# Altium schematic sheet tps79333.SchDoc
size A4; SheetNumber: 4; SheetTotal: 7
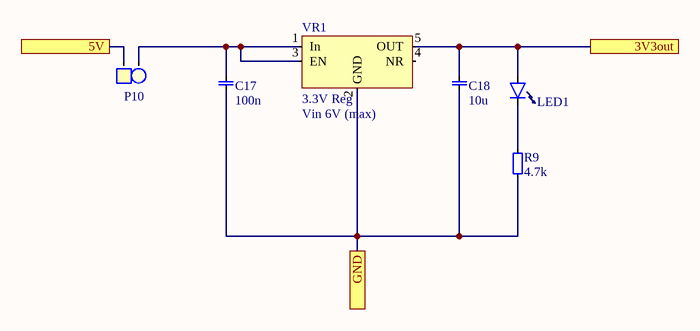
[diagram p0: tps79333.SchDoc]

## Parts
C17  value 100n  [1206, capasitor]  (hidden comment: 1206, capacitor)
C18  value 10u  [1206, capasitor]  (hidden comment: 1206, capacitor)
LED1  0805, LED  [0805_led]  (value not drawn)
P10  1x2 Pin Header  [1x2HEADER]  (value not drawn)
R9  value 4.7k  [1206]  (hidden comment: 1206, resistor)
VR1  3.3V Reg  Input Voltage: Vin 6V (max)  [SOT23-5]

## Ports
3V3out, 5V, GND

## Nets
3V3out: C18.1 LED1.1 VR1.5(OUT) ; port 3V3out
5V: P10.1 ; port 5V
GND: C17.0 C18.0 R9.1 VR1.2(GND) ; port GND
NetC17_1: C17.1 P10.2 VR1.1(In) VR1.3(EN)
NetLED1_0: LED1.0(Cathode) R9.0

Not connected (* = marked no-connect by the designer): VR1 4(NR)

## Library data of the parts
LED1 = 0805, LED: Value: 0805 LED
P10 = 1x2 Pin Header: 2.54 mm, TH; Value: 1x2 Pin Header
R9 = 1206, resistor: Resistor; DigiKey: RMCF1206JT4K70CT-ND
VR1 = TPS79333DBR: 3.3V Reg, Ultra-Low Noise, 200 mA; Value: TPS79333DBVR; Drop Out: 102mV; Farnell: 1287689
C17 C18 = 1206, capacitor
  C17: DigiKey: 399-C1206C104M5RACAUTOCT-ND
  C18: DigiKey: 1276-3298-1-ND